# EAGLE design juicy (EAGLE 8.3.2)
A RESTful power switch.
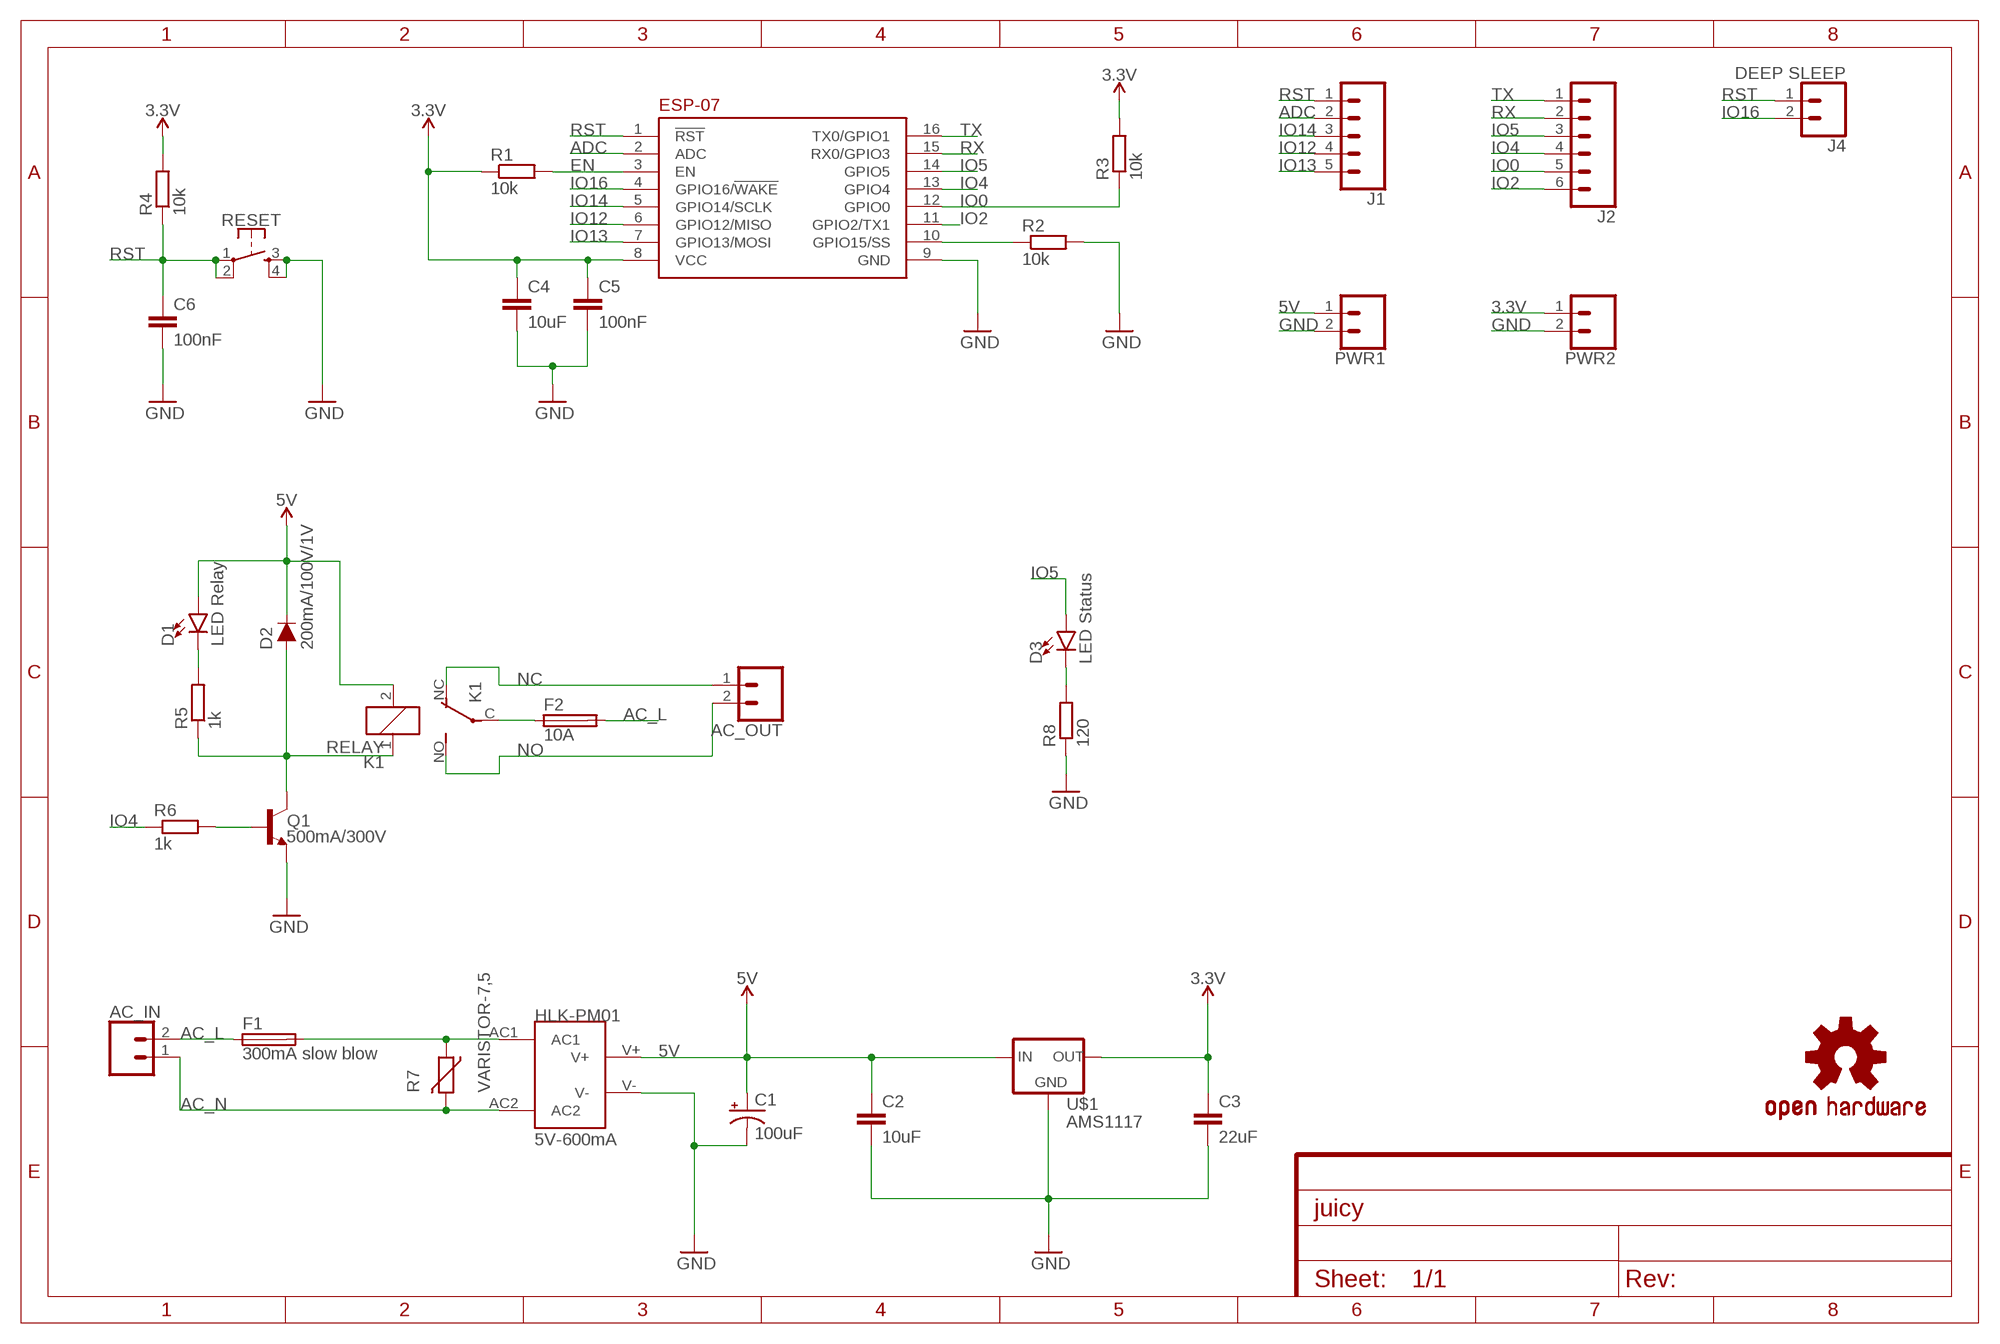
[diagram p0: schematic, sheet 1]

## Parts
AC_IN  CONN_025MM  [SCREWTERMINAL-5MM-2]
AC_OUT  CONN_025MM  [SCREWTERMINAL-5MM-2]
C1  100uF  100UF-POLAR-25V-20%(ELEC)  [PANASONIC_D]
C2  10uF  10UF-0805-10V-10%  [0805]
C3  22uF  22UF-0805-6.3V-20%  [0805]
C4  10uF  10UF-0805-10V-10%  [0805]
C5  100nF  10UF-0805-10V-10%  [0805]
C6  100nF  10UF-0805-10V-10%  [0805]
D1  LED Relay  LED3MM  [LED_3MM]
D2  200mA/100V/1V  DIODE-1N4148  [DIODE-1N4148]
D3  LED Status  LED3MM  [LED_3MM]
F1  300mA slow blow  SH22,5  [SH22,5]
F2  10A  SH22,5  [SH22,5]
J1  CONN_05  [1X05]
J2  CONN_06SILK_FEMALE_PTH  [1X06]
J4  DEEP SLEEP  CONN_02  [1X02]
K1  RELAY  JS-M1-12V-5  [JS-M]
LOGO1  OSHW-LOGOM  [OSHW-LOGO-M]
PWR1  CONN_02  [1X02]
PWR2  CONN_02  [1X02]
Q1  500mA/300V  TRANS_NPN-MMBTA42  [SOT23-3]
R1  10k  R-EU_R0805  [R0805]
R2  10k  R-EU_R0805  [R0805]
R3  10k  R-EU_R0805  [R0805]
R4  10k  R-EU_R0805  [R0805]
R5  1k  R-EU_R0805  [R0805]
R6  1k  R-EU_R0805  [R0805]
R7  VARISTOR-7,5  [R-7,5]
R8  120  R-EU_R0805  [R0805]
RESET  MOMENTARY-SWITCH-SPST-2-SMD-5.2MM  [TACTILE_SWITCH_SMD_5.2MM]
U$1  AMS1117  [SOT223]
U$2  ESP8266  [ESP8266]
U$3  HILINK  [HLK-PM01]

## Nets
3.3V: C3.1 C4.1 C5.1 PWR2.1 R1.1 R3.2 R4.2 U$1.2(OUT) U$1.4(OUT) U$2.8(VCC)
5V: C1.+ C2.1 D1.A D2.C K1.2 PWR1.1 U$1.3(IN) U$3.V+
AC1: F1.2 R7.1 U$3.AC1
AC_L: AC_IN.2 F1.1 F2.2
AC_N: AC_IN.1 R7.2 U$3.AC2
ADC: J1.2 U$2.2(ADC)
EN: R1.2 U$2.3(EN)
GND: C1.- C2.2 C3.2 C4.2 C5.2 C6.2 PWR1.2 PWR2.2 Q1.2(E) R2.2 R8.1 RESET.3 RESET.4 U$1.1(GND) U$2.9(GND) U$3.V-
IO0: J2.5 R3.1 U$2.12(GPIO0)
IO2: J2.6 U$2.11(GPIO2/TX1)
IO4: J2.4 R6.1 U$2.13(GPIO4)
IO5: D3.A J2.3 U$2.14(GPIO5)
IO12: J1.4 U$2.6(GPIO12/MISO)
IO13: J1.5 U$2.7(GPIO13/MOSI)
IO14: J1.3 U$2.5(GPIO14/SCLK)
IO16: J4.2 U$2.4(GPIO16/!WAKE!)
N$1: F2.1 K1.C(2:P)
N$3: R2.1 U$2.10(GPIO15/SS)
N$5: D2.A K1.1 Q1.3(C) R5.1
N$7: D3.K(C) R8.2
N$10: D1.K(C) R5.2
N$13: Q1.1(B) R6.2
NC: AC_OUT.1 K1.NC(2:O)
NO: AC_OUT.2 K1.NO(2:S)
RST: C6.1 J1.1 J4.1 R4.1 RESET.1 RESET.2 U$2.1(!RST!)
RX: J2.2 U$2.15(RX0/GPIO3)
TX: J2.1 U$2.16(TX0/GPIO1)

## Library data of the parts
AC_IN AC_OUT = SparkFun-Connectors:CONN_02: Multi connection point. Often used as Generic Header-pin footprint for 0.1 inch spaced/style header connections On any of the 0.1 inch spaced packages, you can populate with these: Break Away Headers - Straight <https://www.sparkfun.com/products/116> (PRT-00116) Break Away Male Headers - Right Angle <https://www.sparkfun.com/products/553> (PRT-00553) Female Headers <https://www.sparkfun.com/products/115> (PRT-00115) Break Away Headers - Machine Pin <https://www.sparkfun.com/products/117> (PRT-00117) Break Away Female Headers - Swiss Machine Pin <https://www.sparkfun.com/products/743> (PRT-00743) For SCREWTERMINALS and SPRING TERMINALS visit here: Screw Terimnals on SparkFun.com <https://www.sparkfun.com/search/results?term=Screw+Terminals> (5mm/3.5mm/2.54mm spacing) This device is also useful as a general connection point to wire up your design to another part of your project. Our various solder wires solder well into these plated through hole pads. Hook-Up Wire - Assortment (Stranded, 22 AWG) <https://www.sparkfun.com/products/11375> (PRT-11375) Hook-Up Wire - Assortment (Solid Core, 22 AWG) <https://www.sparkfun.com/products/11367> (PRT-11367) View the entire wire category on our website here <https://www.sparkfun.com/categories/141> Special notes: Molex polarized connector foot print use with: PRT-08233 with associated crimp pins and housings. 2.54_SCREWTERM for use with PRT-10571. 3.5mm Screw Terminal footprints for PRT-08084 5mm Screw Terminal footprints for use with PRT-08432; SF_SKU: PRT-08432
C1 = SparkFun-Capacitors:100UF-POLAR: 100µF polarized capacitors A capacitor is a passive two-terminal electrical component used to store electrical energy temporarily in an electric field.; PROD_ID: CAP-12547
C2 C4 = SparkFun-Capacitors:10UF: 10.0µF ceramic capacitors A capacitor is a passive two-terminal electrical component used to store electrical energy temporarily in an electric field.; PROD_ID: CAP-11330
C3 = SparkFun-Capacitors:22UF: 22µF ceramic capacitors A capacitor is a passive two-terminal electrical component used to store electrical energy temporarily in an electric field.; PROD_ID: CAP-08402
C5 C6 = SparkFun-Capacitors:10UF: 10.0µF ceramic capacitors A capacitor is a passive two-terminal electrical component used to store electrical energy temporarily in an electric field.; PROD_ID: CAP-11330; VALUE: 10uF
D1 D3 = SparkFun-LED:LED: LED (Generic) Standard schematic elements and footprints for 5mm, 3mm, 1206, and 0603 sized LEDs. Generic LEDs with no color specified.; PROD_ID: DIO-08794
D2 = SparkFun-DiscreteSemi:DIODE: Diode These are standard reverse protection diodes and small signal diodes. SparkFun Products: SparkFun SparkPunk Sound Kit <https://www.sparkfun.com/products/11177> SparkFun ESP8266 Thing <https://www.sparkfun.com/products/13231>; PROD_ID: DIO-08378
F1 F2 = fuse:SH22,5: FUSE HOLDER grid 22,5 mm, OGN0031 8201, Schurter (Buerklin); MF: SCHURTER; MPN: 0031.8201; OC_FARNELL: 1162740; OC_NEWARK: 96F8317
J1 = SparkFun-Connectors:CONN_05: Multi connection point. Often used as Generic Header-pin footprint for 0.1 inch spaced/style header connections On any of the 0.1 inch spaced packages, you can populate with these: Break Away Headers - Straight <https://www.sparkfun.com/products/116> (PRT-00116) Break Away Male Headers - Right Angle <https://www.sparkfun.com/products/553> (PRT-00553) Female Headers <https://www.sparkfun.com/products/115> (PRT-00115) Break Away Headers - Machine Pin <https://www.sparkfun.com/products/117> (PRT-00117) Break Away Female Headers - Swiss Machine Pin <https://www.sparkfun.com/products/743> (PRT-00743) For SCREWTERMINALS and SPRING TERMINALS visit here: Screw Terimnals on SparkFun.com <https://www.sparkfun.com/search/results?term=Screw+Terminals> (5mm/3.5mm/2.54mm spacing) This device is also useful as a general connection point to wire up your design to another part of your project. Our various solder wires solder well into these plated through hole pads. Hook-Up Wire - Assortment (Stranded, 22 AWG) <https://www.sparkfun.com/products/11375> (PRT-11375) Hook-Up Wire - Assortment (Solid Core, 22 AWG) <https://www.sparkfun.com/products/11367> (PRT-11367) View the entire wire category on our website here <https://www.sparkfun.com/categories/141> Special notes: Molex polarized connector foot print use with SKU : PRT-08231 with associated crimp pins and housings. 1MM SMD Version SKU: PRT-10208
J2 = SparkFun-Connectors:CONN_06: Multi connection point. Often used as Generic Header-pin footprint for 0.1 inch spaced/style header connections On any of the 0.1 inch spaced packages, you can populate with these: Break Away Headers - Straight <https://www.sparkfun.com/products/116> (PRT-00116) Break Away Male Headers - Right Angle <https://www.sparkfun.com/products/553> (PRT-00553) Female Headers <https://www.sparkfun.com/products/115> (PRT-00115) Break Away Headers - Machine Pin <https://www.sparkfun.com/products/117> (PRT-00117) Break Away Female Headers - Swiss Machine Pin <https://www.sparkfun.com/products/743> (PRT-00743) Arduino Stackable Header - 6 Pin <https://www.sparkfun.com/products/9280> (PRT-09280) For SCREWTERMINALS and SPRING TERMINALS visit here: Screw Terimnals on SparkFun.com <https://www.sparkfun.com/search/results?term=Screw+Terminals> (5mm/3.5mm/2.54mm spacing) This device is also useful as a general connection point to wire up your design to another part of your project. Our various solder wires solder well into these plated through hole pads. Hook-Up Wire - Assortment (Stranded, 22 AWG) <https://www.sparkfun.com/products/11375> (PRT-11375) Hook-Up Wire - Assortment (Solid Core, 22 AWG) <https://www.sparkfun.com/products/11367> (PRT-11367) View the entire wire category on our website here <https://www.sparkfun.com/categories/141>; PROD_ID: CONN-08437
J4 PWR1 PWR2 = SparkFun-Connectors:CONN_02: Multi connection point. Often used as Generic Header-pin footprint for 0.1 inch spaced/style header connections On any of the 0.1 inch spaced packages, you can populate with these: Break Away Headers - Straight <https://www.sparkfun.com/products/116> (PRT-00116) Break Away Male Headers - Right Angle <https://www.sparkfun.com/products/553> (PRT-00553) Female Headers <https://www.sparkfun.com/products/115> (PRT-00115) Break Away Headers - Machine Pin <https://www.sparkfun.com/products/117> (PRT-00117) Break Away Female Headers - Swiss Machine Pin <https://www.sparkfun.com/products/743> (PRT-00743) For SCREWTERMINALS and SPRING TERMINALS visit here: Screw Terimnals on SparkFun.com <https://www.sparkfun.com/search/results?term=Screw+Terminals> (5mm/3.5mm/2.54mm spacing) This device is also useful as a general connection point to wire up your design to another part of your project. Our various solder wires solder well into these plated through hole pads. Hook-Up Wire - Assortment (Stranded, 22 AWG) <https://www.sparkfun.com/products/11375> (PRT-11375) Hook-Up Wire - Assortment (Solid Core, 22 AWG) <https://www.sparkfun.com/products/11367> (PRT-11367) View the entire wire category on our website here <https://www.sparkfun.com/categories/141> Special notes: Molex polarized connector foot print use with: PRT-08233 with associated crimp pins and housings. 2.54_SCREWTERM for use with PRT-10571. 3.5mm Screw Terminal footprints for PRT-08084 5mm Screw Terminal footprints for use with PRT-08432
K1 = relay:JS-M1*: Automotive Ultra-Miniature Power Relay NAiS Source: http://www.mew-europe.com/.. en_ds_61211_0000.pdf; MF: FARNELL; MPN: JSM1-12V-5; OC_FARNELL: 910351; OC_NEWARK: 14J1764
LOGO1 = SparkFun-Aesthetics:OSHW-LOGO: Open-Source Hardware (OSHW) Logo This logo indicates the piece of hardware it is found on incorporates a OSHW license and/or adheres to the definition of open source hardware found here: http://freedomdefined.org/OSHW
Q1 = SparkFun-DiscreteSemi:TRANS_NPN: NPN transistor Current controlled devices typically used to amplify current or used as a switch. BC547 - COM-08928 <http://www.sparkfun.com/products/8928> (TO-92 45V 100mA) (1.Collector 2.Base 3.Emitter) 2N3904 - COM-00521 <http://www.sparkfun.com/products/521> (TO-92 40V 200mA) (1.Emitter 2.Base 3.Collector) P2N2222A - COM-12852 <http://www.sparkfun.com/products/12852> (TO-92 40V 600mA) (1.Collector 2.Base 3.Emitter); PROD_ID: TRANS-09116
R1-R6 R8 = resistor:R-EU_: RESISTOR, European symbol
R7 = varistor:VARISTOR: VARISTOR
RESET = SparkFun-Switches:MOMENTARY-SWITCH-SPST-2: Momentary Switch (Pushbutton) - SPST - Two Circuits Normally-open (NO) SPST momentary switches (buttons, pushbuttons). Schematic symbol includes two switch circuits. Variants SMD-4.6MMX2.8MM - 4.60mm x 2.80mm Tactile Momentary Button Switch - Used on SparkFun SAMD21 Mini Breakout <https://www.sparkfun.com/products/13664> SMD-5.2MM - Mini Pushbutton Switch - SMD <https://www.sparkfun.com/products/8720> - Used on Arduino Pro Mini <https://www.sparkfun.com/products/11114>; PROD_ID: SWCH-08247; SF_SKU: COM-08720
U$1 = juiy-lib:AMS1117
U$2 = juiy-lib:ESP8266
U$3 = juiy-lib:HILINK

## Board
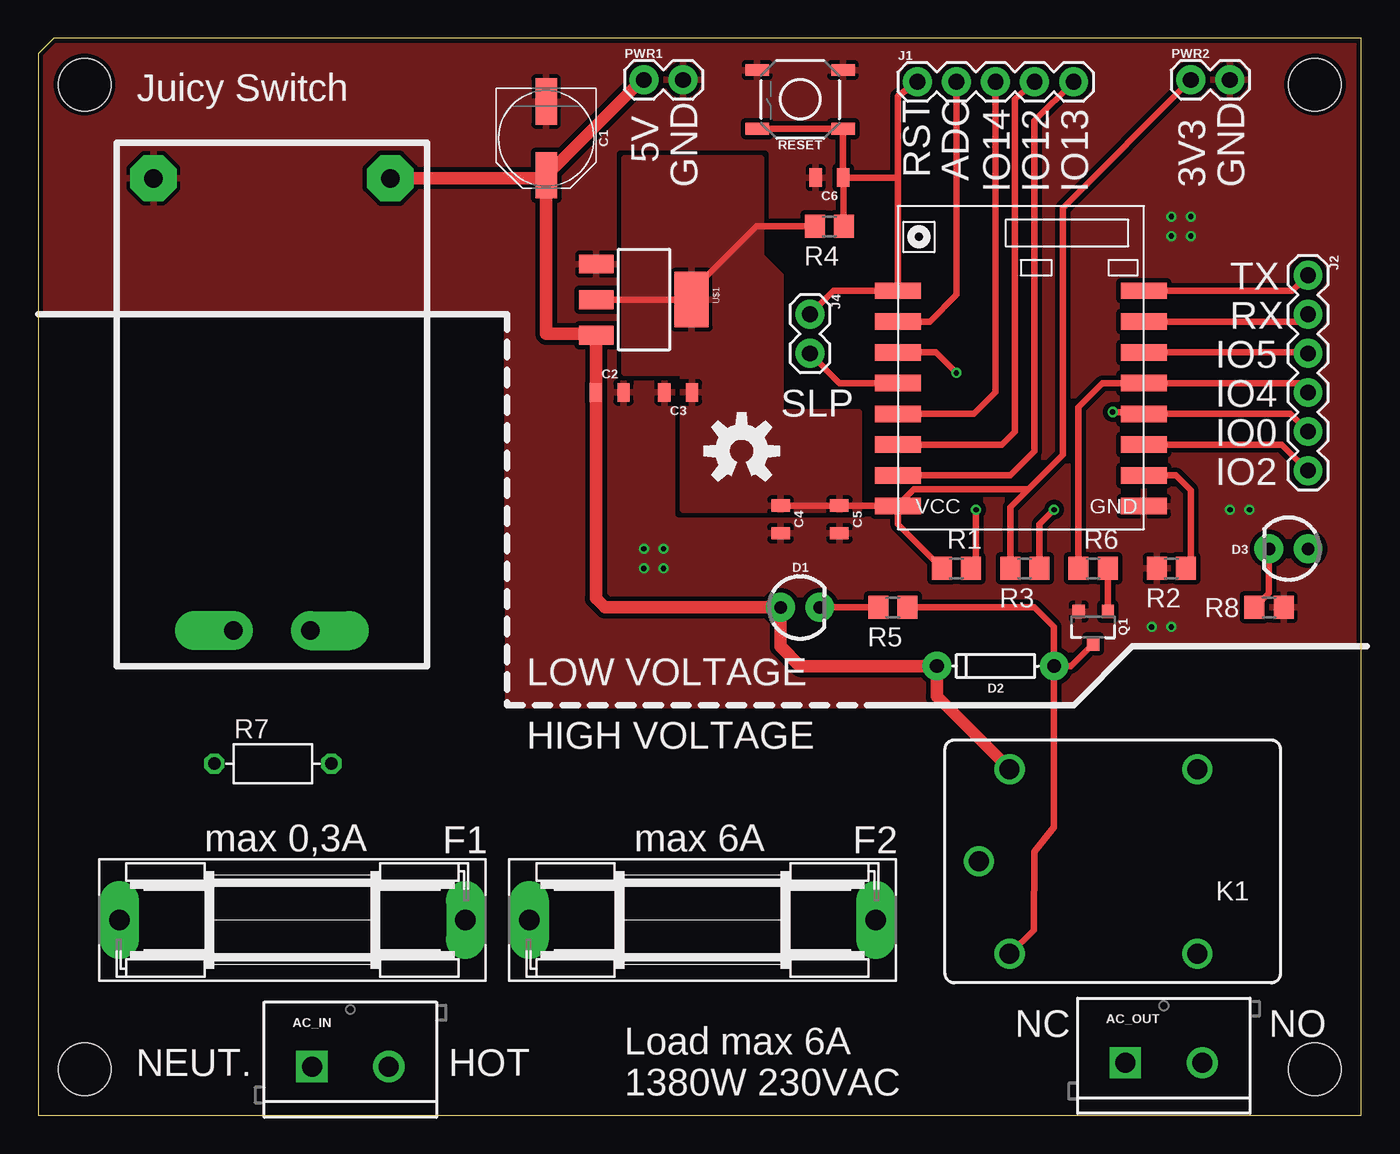
[diagram p1: board, top side]
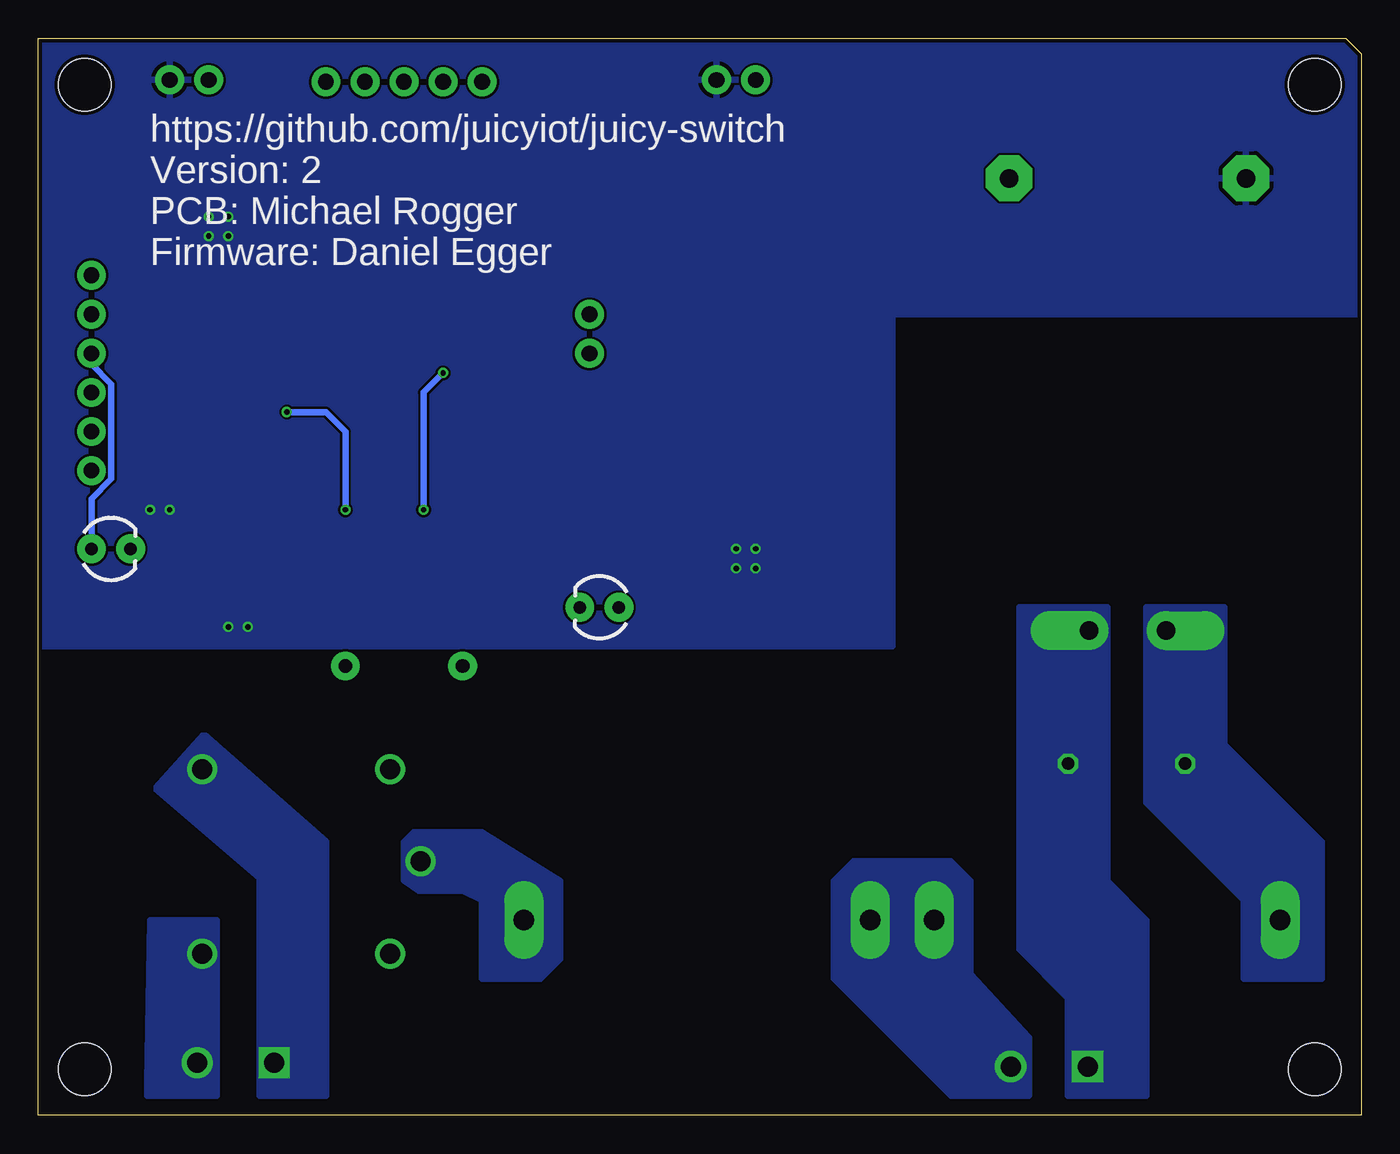
[diagram p2: board, bottom side, seen from below]

Size 86 x 70 mm. Coordinates in mm from the lower left corner, seen from the top.
Outline: 0,0 86,0 86,70 1,70 0,69 0,0
Copper layers (1*16): Top 0.035mm / dielectric 1.5mm / Bottom 0.035mm
Design rules "SeeedStudio_2layer_DRU_no_angle_20140221": minimum track width 6mil, minimum drill 12mil, track to track 6mil, track to pad 6mil, pad to pad 6mil, via to via 6mil, smd to smd 0mil, copper to edge 10mil, drill to drill 10mil, minimum pad ring 10mil, minimum via ring 6mil, stop-mask expansion 2mil, vias tented up to drill 100mil, thermal gap 10mil
Holes 3.4 mm at 3,67 3,3 83,3 83,67

### Footprints (pad centres in the part's own frame; a part is rotated, then mirrored left to right if it is on the bottom)
SCREWTERMINAL-5MM-2 = drill 1.3 pad 2.032 square: 1 0,0 | drill 1.3 pad 2.032: 2 5,0
PANASONIC_D = smd 3 x 1.4: + 2.4,0; - -2.4,0
0805 = smd 0.8 x 1.2: 1 -0.9,0; 2 0.9,0
LED_3MM = drill 0.813 pad 1.88: A -1.27,0; K 1.27,0
DIODE-1N4148 = drill 0.9 pad 1.88: A -3.81,0; C 3.81,0
SH22,5 = drill 1.321 pad 2.54 long: 1 -11.252,0; 2 11.252,0
1X05 = drill 1.016 pad 1.88: 1 0,0; 2 2.54,0; 3 5.08,0; 4 7.62,0; 5 10.16,0
1X06 = drill 1.016 pad 1.88: 1 0,0; 2 2.54,0; 3 5.08,0; 4 7.62,0; 5 10.16,0; 6 12.7,0
1X02 = drill 1.016 pad 1.88: 1 0,0; 2 2.54,0
JS-M = drill 1.3: 1 6.7,6; 2 6.7,-6; C 8.7,0; NC -5.5,-6; NO -5.5,6
SOT23-3 = smd 0.8 x 0.9: 1 -0.95,-1; 2 0.95,-1; 3 0,1.1
R0805 = smd 1.3 x 1.5: 1 -0.95,0; 2 0.95,0
R-7,5 = drill 0.813 octagon: 1 -3.81,0; 2 3.81,0
TACTILE_SWITCH_SMD_5.2MM = smd 1.524 x 0.762: 1 -2.794,1.905; 2 2.794,1.905; 3 -2.794,-1.905; 4 2.794,-1.905
SOT223 = smd 1.219 x 2.235: 1 -2.311,-3.099; 2 0,-3.099; 3 2.311,-3.099 | smd 3.6 x 2.2: 4 0,3.099
ESP8266 = smd 3 x 1.067: 1 0,15.5; 2 0,13.5; 3 0,11.5; 4 0,9.5; 5 0,7.5; 6 0,5.5; 7 0,3.5; 8 0,1.5; 9 16,1.5; 10 16,3.5; 11 16,5.5; 12 16,7.5; 13 16,9.5; 14 16,11.5; 15 16,13.5; 16 16,15.5
HLK-PM01 = drill 1.2 pad 2.54 offset: AC1 7.6,2.3; AC2 12.6,2.3 | drill 1.2 pad 3 octagon: V+ 17.8,31.7; V- 2.4,31.7

### Placement (x,y rotation side)
AC_IN  17.78,3.17 0 top
AC_OUT  70.68,3.43 0 top
C1  33.02,63.5 270 top
C2  37.15,46.99 0 top
C3  41.59,46.99 180 top
C4  48.26,38.73 270 top
C5  52.07,38.73 270 top
C6  51.44,60.96 180 top
D1  49.53,33.02 0 top
D2  62.23,29.21 180 top
D3  81.28,36.83 180 top
F1  16.51,12.7 180 top
F2  43.18,12.7 180 top
J1  57.15,67.18 0 top
J2  82.55,54.61 270 top
J4  50.16,52.07 270 top
K1  69.85,16.51 180 top
LOGO1  45.72,43.18 0 top
PWR1  39.37,67.31 0 top
PWR2  74.93,67.31 0 top
Q1  68.58,31.75 180 top
R1  59.69,35.56 0 top
R2  73.66,35.56 180 top
R3  64.14,35.56 180 top
R4  51.44,57.78 180 top
R5  55.56,33.02 180 top
R6  68.58,35.56 0 top
R7  15.24,22.86 0 top
R8  80.01,33.02 180 top
RESET  49.53,66.04 180 top
U$1  39.37,53.02 270 top
U$2  55.88,38.1 0 top
U$3  5.08,29.21 0 top

### Tracks (layer width: path | path; a pad name or v marks a point on that pad's centre or on a via)
3.3V
  Top 0.406: 42.47,47.01 C3.1 | 41.91,53.02 U$1.2 | 41.91,53.02 U$1.4 | 55.84,39.63 C5.1 C4.1 | 55.84,39.63 U$2.8 55.88,38.42 R1.1 | R4.2 46.67,57.78 41.91,53.02 | 64.36,40.71 66.6,42.95 66.6,58.98 PWR2.1 | 64.36,40.71 56.92,40.71 55.84,39.63 | R3.2 63.19,39.53 64.36,40.71
  pour Top (isolate 0.305): 38.1,62.23 38.1,48.26 41.91,48.26 41.91,39.37 53.34,39.37 53.34,45.72 48.26,45.72 48.26,54.61 46.99,55.88 46.99,62.23
5V
  Top 0.813: K1.2 58.42,27.24 D2.C 49.53,29.21 48.26,30.48 D1.A 36.83,33.02 36.25,33.6 C2.1 36.27,47.01 U$1.3 36.18,50.8 33.02,50.8 C1.+ 32.83,60.91 | 32.83,60.91 U$3.V+ | PWR1.1 39.23,67.31 32.83,60.91
AC1
  pour Bottom (no thermals): 13.97,33.02 13.97,20.32 7.62,13.97 7.62,8.89 2.54,8.89 2.54,17.78 8.89,24.13 8.89,33.02
AC_L
  pour Bottom (no thermals): 21.59,1.27 26.67,1.27 34.29,8.89 34.29,15.24 33.02,16.51 26.67,16.51 25.4,15.24 25.4,9.21 21.59,5.08
AC_N
  pour Bottom (no thermals): 16.51,33.02 16.51,15.24 13.97,12.7 13.97,1.27 19.05,1.27 19.05,7.62 22.23,10.79 22.23,33.02
ADC
  Top 0.406: J1.2 59.69,53.34 57.95,51.6 U$2.2
EN  (via drill 0.35)
  Top 0.406: v59.69,48.26 58.35,49.6 U$2.3 | v60.96,39.37 60.96,35.88 R1.2
  Bottom 0.406: v59.69,48.26 60.96,46.99 v60.96,39.37
GND  (via drill 0.35)
  other vias: 74.93,58.42 73.66,58.42 39.37,36.83 40.64,36.83 40.64,35.56 39.37,35.56 73.66,57.15 74.93,57.15 78.74,39.37 73.66,31.75 72.39,31.75 77.47,39.37
  pour Top (isolate 0.305, rank 2): -1.27,70.77 -1.27,52.07 30.48,52.07 30.54,26.67 67.31,26.67 71.12,30.48 87.63,30.48 87.63,70.94
  pour Bottom: 87.63,71.12 87.63,30.48 30.48,30.48 30.48,52.07 -1.27,52.07 -1.27,71.12
IO0  (via drill 0.35)
  Top 0.406: R3.1 65.08,38.41 v66.04,39.37 | v69.85,45.72 72,45.72 U$2.12 81.4,45.6 J2.5
  Bottom 0.406: v66.04,39.37 66.04,44.45 67.31,45.72 v69.85,45.72
IO2
  Top 0.406: U$2.11 80.86,43.6 J2.6
IO4
  Top 0.406: R6.1 67.63,46.04 69.19,47.6 U$2.13 81.94,47.6 J2.4
IO5
  Top 0.406: U$2.14 82.48,49.6 J2.3
  Bottom 0.406: J2.3 82.55,48.82 81.25,47.53 81.25,41.37 82.55,40.08 D3.A
IO12
  Top 0.406: U$2.6 62.65,43.6 63.5,44.45 63.5,66.04 J1.4
IO13
  Top 0.406: U$2.7 63.19,41.6 64.77,43.18 64.77,64.64 J1.5
IO14
  Top 0.406: U$2.5 60.84,45.6 62.23,46.99 J1.3
IO16
  Top 0.406: U$2.4 52.09,47.6 J4.2
N$1
  pour Bottom (no thermals): 57.15,18.41 61.59,18.41 62.23,17.78 62.23,15.24 61.28,14.61 58.42,14.61 57.15,13.97 57.15,8.89 53.34,8.89 52.07,10.16 52.07,15.24
N$3
  Top 0.406: U$2.10 73.97,41.6 74.93,40.64 74.93,35.88 R2.1
N$5
  Top 0.406: D2.A 67.14,29.21 Q1.3 | K1.1 64.74,12.03 64.77,17.14 66.04,18.73 D2.A | D2.A 66.04,31.75 64.77,33.02 R5.1
N$7
  Top 0.406: 78.74,33.34 R8.2 79.95,33.91 79.95,33.92 80.01,33.97 D3.K
N$10
  Top 0.406: R5.2 D1.K
N$13
  Top 0.406: R6.2 Q1.1
NC
  pour Bottom (no thermals): 71.63,1.27 71.63,15.43 78.42,21.27 75.25,24.77 67.31,17.78 67.31,1.27
NO
  pour Bottom (no thermals): 74.42,12.7 74.42,1.27 78.93,1.27 78.93,2.1 78.74,12.7
RST
  Top 0.406: RESET.2 RESET.1 52.32,60.97 C6.1 | 55.62,53.34 U$2.1 | 55.88,60.96 U$2.1 | 55.88,60.96 55.88,66.23 J1.1 | U$2.1 51.7,53.6 J4.1 | C6.1 55.88,60.96 | C6.1 52.34,57.84 R4.1
RX
  Top 0.406: U$2.15 82.08,51.6 J2.2
TX
  Top 0.406: U$2.16 81.54,53.6 J2.1

### Text on the board
tPlace: Juicy Switch | LOW VOLTAGE | HIGH VOLTAGE | max 0,3A | max 6A | NC | NO | NEUT. | HOT | Load max 6A / 1380W 230VAC
tNames: RST | ADC | 5V | GND | IO14 | IO12 | IO13 | 3V3 | GND | TX | RX | IO5 | IO4 | SLP | IO0 | IO2
bNames: https://github.com/juicyiot/juicy-switch / Version: 2 / PCB: Michael Rogger / Firmware: Daniel Egger